# EAGLE design squall-blees-board (EAGLE 7.3.0)
AUTHOR: BLEES Dev Team; REV: A; TITLE: BLEES Sensor Board
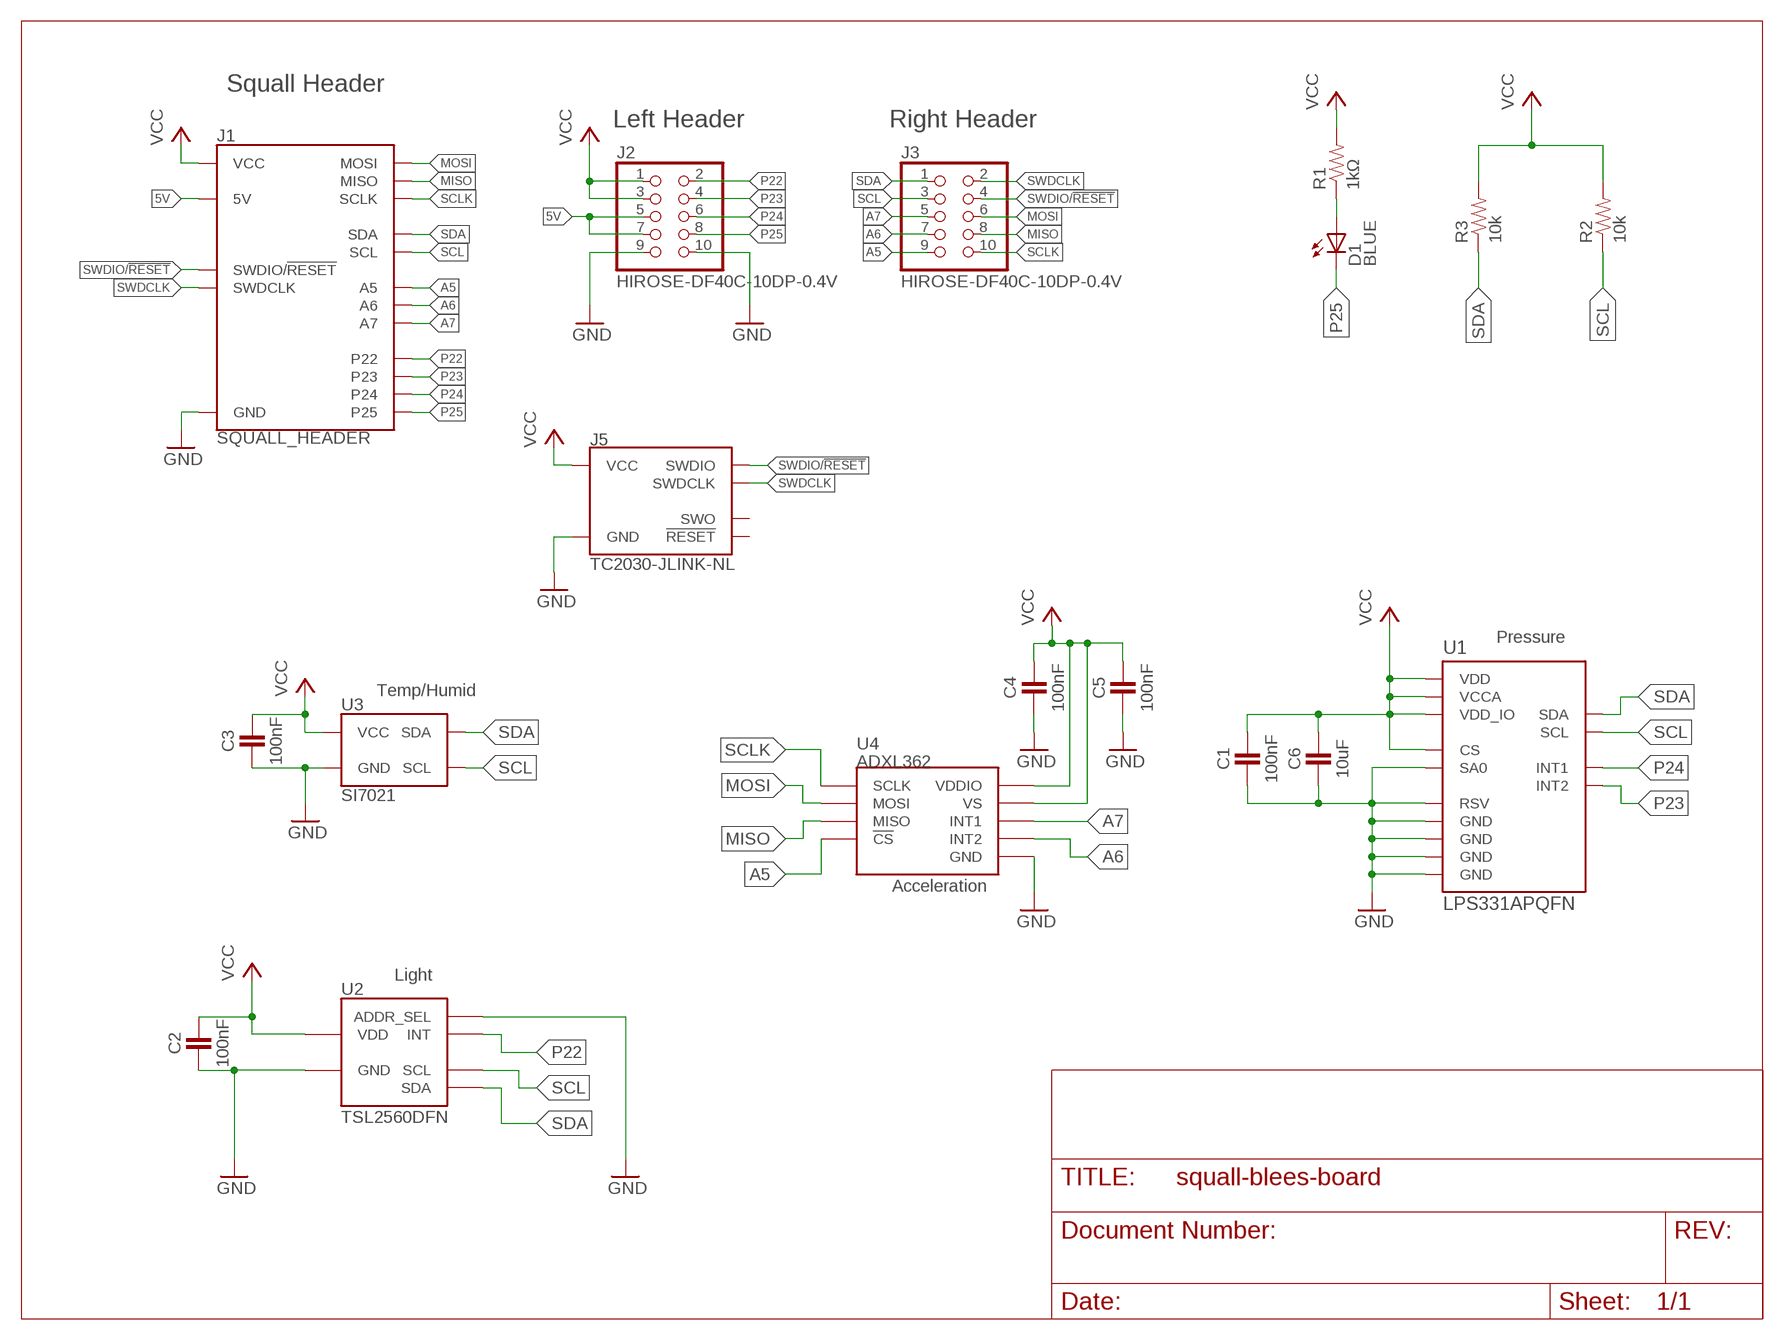
[diagram p0: schematic, sheet 1]

## Parts
C1  100nF  CAPACITOR  [0402_CAP]
C2  100nF  CAPACITOR  [0402_CAP]
C3  100nF  CAPACITOR  [0402_CAP]
C4  100nF  CAPACITOR  [0402_CAP]
C5  100nF  CAPACITOR  [0402_CAP]
C6  10uF  CAPACITOR0603_CAP  [0603_CAP]
D1  BLUE  LED0603  [LED-0603]
J1  SQUALL_HEADER  [SQUALL_HEADER]
J2  HIROSE-DF40C-10DP-0.4V  [2X5/SMD/0.4MM]
J3  HIROSE-DF40C-10DP-0.4V  [2X5/SMD/0.4MM]
J5  TC2030-JLINK-NL  [TC2030-IDC-NL]
R1  1kΩ  RESISTOR0402_RES  [0402_RES]
R2  10k  RESISTOR0402_RES  [0402_RES]
R3  10k  RESISTOR0402_RES  [0402_RES]
U1  LPS331APQFN  [HCLGA-16L]
U2  TSL2560DFN  [DFN2]
U3  SI7021  [DFN-6/3MM]
U4  ADXL362  [ADXL362]

## Nets
5V: J1.A5(5V) J1.A7(5V) J2.5 J2.7
A5: J1.B9(A5) J3.9 U4.P$8(!CS)
A6: J1.B7(A6) J3.7 U4.P$9(INT2)
A7: J1.B5(A7) J3.5 U4.P$11(INT1)
GND: C1.2 C2.2 C3.2 C4.2 C5.2 C6.2 J1.A9(GND) J1.A10(GND) J2.9 J2.10 J5.5(GND) U1.5(GND) U1.7(SA0) U1.10(RSV) U1.12(GND) U1.13(GND) U1.16(GND) U2.2(ADDR_SEL) U2.3(GND) U3.2(GND) U4.P$12(GND) U4.P$13(GND) U4.P$16(GND)
MISO: J1.B8(MISO) J3.8 U4.P$7(MISO)
MOSI: J1.B6(MOSI) J3.6 U4.P$6(MOSI)
N$2: D1.A R1.1
P22: J1.A2(P22) J2.2 U2.5(INT)
P23: J1.A4(P23) J2.4 U1.9(INT2)
P24: J1.A6(P24) J2.6 U1.11(INT1)
P25: D1.C J1.A8(P25) J2.8
SCL: J1.B3(SCL) J3.3 R2.1 U1.4(SCL) U2.4(SCL) U3.6(SCL)
SCLK: J1.B10(SCLK) J3.10 U4.P$4(SCLK)
SDA: J1.B1(SDA) J3.1 R3.1 U1.6(SDA) U2.6(SDA) U3.1(SDA)
SWDCLK: J1.B2(SWDCLK) J3.2 J5.4(SWDCLK)
SWDIO/!RESET: J1.B4(SWDIO/!RESET) J3.4 J5.2(SWDIO)
VCC: C1.1 C2.1 C3.1 C4.1 C5.1 C6.1 J1.A1(VCC) J1.A3(VCC) J2.1 J2.3 J5.1(VCC) R1.2 R2.2 R3.2 U1.1(VDD_IO) U1.8(CS) U1.14(VDD) U1.15(VCCA) U2.1(VDD) U3.5(VCC) U4.P$1(VDDIO) U4.P$14(VS)
Unconnected: J5.3(!RESET) J5.6(SWO)

## Notes on the sheet
- Squall Header
- Left Header | Right Header
- Pressure
- Temp/Humid
- Acceleration
- Light

## Library data of the parts
C1-C6 = passives:CAPACITOR: 0402 Capacitor
D1 = SparkFun-LED:LED: LEDs Standard schematic elements and footprints for 5mm, 3mm, 1206, and 0603 sized LEDs. 5mm - Spark Fun Electronics SKU : COM-00529 (and others)
J1 = squall:SQUALL_HEADER: Header for a sensor board on top of the Squall BLE tag board. Requires two DF40C-10DS-0.4V(51).; DIGIKEY: H11617CT-ND
J2 J3 = headers:HIROSE-DF40C-10DP-0.4V: DF40 Series Header - 0.4MM Pitch; DIGIKEY: H11616CT-ND; MOUSER: 798-DF40C10DP0.4V51; NEWARK: 68X2585
J5 = connector:TC2030-JLINK
R1-R3 = passives:RESISTOR: Resistor Basic schematic elements and footprints for 0603, 1206, and PTH resistors.
U1 = blees:LPS331AP: LPS331AP pressure sensor device designed by BLEES EECS 373
U2 = blees:TSL2560: TSL2560 light to digital converter, written by BLEES EECS 373.
U3 = chips:SI7021: IC TEMP SENSOR RH 2% DFN; DIGIKEY: 336-2542-1-ND
U4 = SparkFun-Sensors:ADXL362: Micropower 3-axis accelerometer 2/4/8g digital output (SPI)

## Board
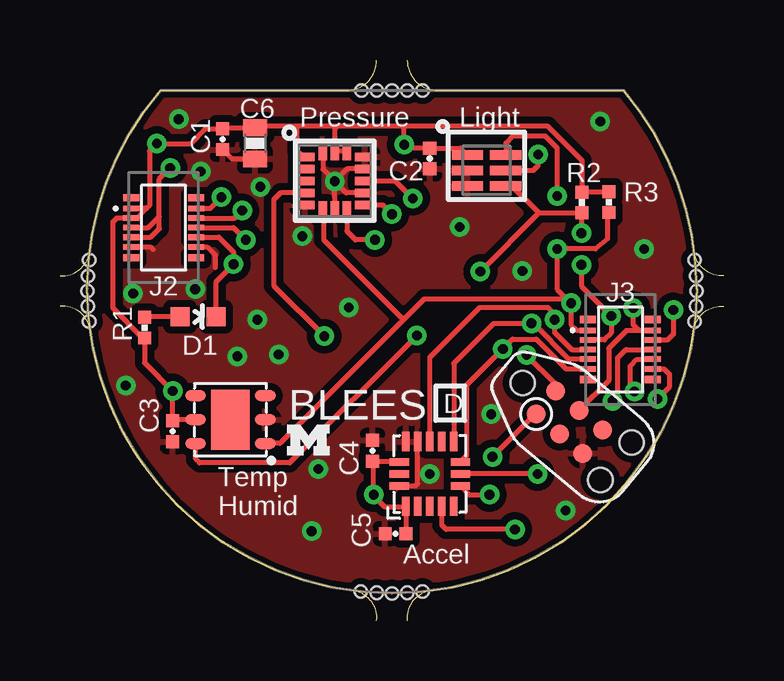
[diagram p1: board, top side]
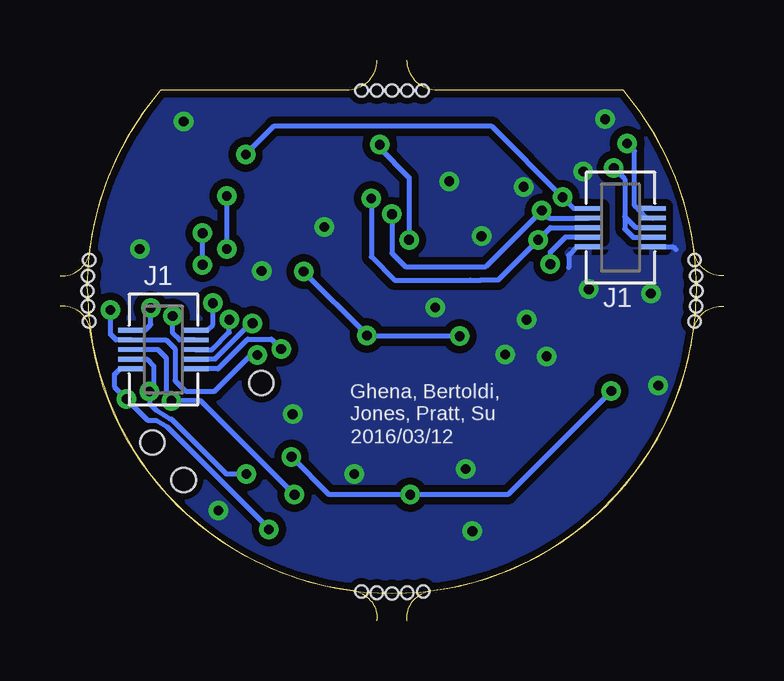
[diagram p2: board, bottom side, seen from below]

Size 27.69 x 23.37 mm. Coordinates in mm from the lower left corner, seen from the top.
Outline: 13.21,23.37 arc-90 11.94,22.1 4.19,22.1 arc33 1.24,15.44 arc-90 0,14.38
Outline: 14.48,23.37 arc90 15.75,22.1 23.49,22.1 arc-33 26.44,15.44 arc90 27.69,14.38
Outline: 0,13.11 arc-90 1.27,12.04 arc75 12.22,1.25 arc-90 13.21,0
Outline: 27.69,13.11 arc90 26.42,12.04 arc-75 15.47,1.25 arc90 14.48,0
Copper layers (1*16): Top 0.0178mm / dielectric 59mil / Bottom 0.0178mm
Design rules "sunstone-2lyr_v1.0.0.3 *": minimum track width 6mil, minimum drill 14mil, track to track 6mil, track to pad 6mil, pad to pad 6mil, via to via 6mil, smd to smd 6mil, copper to edge 10mil, drill to drill 16mil, minimum pad ring 8mil, minimum via ring 8mil, stop-mask expansion 3mil, vias tented up to drill 50mil, thermal gap 10mil
Holes 0.51 mm at 13.84,22.1 14.48,22.1 15.11,22.1 13.21,22.1 12.57,22.1 1.14,13.74 1.17,14.38 1.22,15.04 1.17,13.11 1.22,12.47 26.54,13.74 26.52,14.38 26.47,15.04 26.52,13.11 26.47,12.47 13.84,1.14 13.21,1.17 12.55,1.22 14.48,1.17 15.11,1.22
Milling: 4 lines

### Footprints (pad centres in the part's own frame; a part is rotated, then mirrored left to right if it is on the bottom)
0402_CAP = smd 0.536 x 0.546: 1 -0.433,0; 2 0.433,0
0603_CAP = smd 0.7 x 1: 1 -0.65,0; 2 0.65,0
LED-0603 = smd 0.8 x 0.8: A 0,-0.75; C 0,0.75
SQUALL_HEADER = smd 1.14 x 0.2 bottom: A1 -10.845,3.34; A2 -8.205,3.34; A3 -10.845,2.94; A4 -8.205,2.94; A5 -10.845,2.54; A6 -8.205,2.54; A7 -10.845,2.14; A8 -8.205,2.14; A9 -10.845,1.74; A10 -8.205,1.74; B1 8.205,-1.74; B2 10.845,-1.74; B3 8.205,-2.14; B4 10.845,-2.14; B5 8.205,-2.54; B6 10.845,-2.54; B7 8.205,-2.94; B8 10.845,-2.94; B9 8.205,-3.34; B10 10.845,-3.34
2X5/SMD/0.4MM = smd 0.66 x 0.23: 1 -1.355,0.8; 2 1.355,0.8; 3 -1.355,0.4; 4 1.355,0.4; 5 -1.355,0; 6 1.355,0; 7 -1.355,-0.4; 8 1.355,-0.4; 9 -1.355,-0.8; 10 1.355,-0.8 | smd 0.66 x 0.3: A -1.355,1.25; B 1.355,1.25; C -1.355,-1.25; D 1.355,-1.25
TC2030-IDC-NL = smd 0.787 x 0.787: 1 -1.27,-0.635; 2 -1.27,0.635; 3 0,-0.635; 4 0,0.635; 5 1.27,-0.635; 6 1.27,0.635 | hole 1.016: -2.54,0; 2.54,1.016; 2.54,-1.016
0402_RES = smd 0.536 x 0.546: 1 -0.433,0; 2 0.433,0
HCLGA-16L = smd 0.8 x 0.35: 1 -1.25,1; 2 -1.25,0.5; 3 -1.25,0; 4 -1.25,-0.5; 5 -1.25,-1; 9 1.25,-1; 10 1.25,-0.5; 11 1.25,0; 12 1.25,0.5; 13 1.25,1 | smd 0.35 x 0.8: 6 -0.5,-1.25; 7 0,-1.25; 8 0.5,-1.25; 14 0.5,1.25; 15 0,1.25; 16 -0.5,1.25
DFN2 = smd 1.3 x 0.4: 1 -0.8,0.65; 2 -0.8,0; 3 -0.8,-0.65; 4 0.8,-0.65; 5 0.8,0; 6 0.8,0.65
DFN-6/3MM = smd 0.85 x 0.45: 1 -1.45,1; 2 -1.45,0; 3 -1.45,-1; 4 1.45,-1; 5 1.45,0; 6 1.45,1 | smd 1.6 x 2.5: P$1 0,0
ADXL362 = smd 0.8 x 0.3: P$1 -1.35,1; P$2 -1.35,0.5; P$3 -1.35,0; P$4 -1.35,-0.5; P$5 -1.35,-1; P$9 1.35,-1; P$10 1.35,-0.5; P$11 1.35,0; P$12 1.35,0.5; P$13 1.35,1 | smd 0.3 x 0.8: P$6 -0.5,-1.275; P$7 0,-1.275; P$8 0.5,-1.275; P$14 0.5,1.275; P$15 0,1.275; P$16 -0.5,1.275

### Placement (x,y rotation side)
C1  6.78,20.07 270 top
C2  15.42,19.26 270 top
C3  4.7,7.9 270 top
C4  13.03,7.09 90 top
C5  14,3.63 180 top
C6  8.13,19.89 270 top
D1  5.77,12.67 270 top
J1  13.84,13.84 0 top
J2  4.32,16.38 0 top
J3  23.37,11.3 0 top
J5  21.23,8.28 320 top
R1  3.53,12.22 270 top
R2  21.76,17.43 90 top
R3  22.89,17.44 90 top
U1  11.46,18.33 0 top
U2  17.79,18.77 0 top
U3  7.11,8.38 180 top
U4  15.42,6.12 90 top
U$1  [UMICH_SOLID_50MIL]  10.36,7.54 0 top

### Tracks (layer width: path | path; a pad name or v marks a point on that pad's centre or on a via)
5V  (via drill 0.41)
  Top 0.203: J2.7 3.79,15.98 4.14,16.33 4.14,16.84 | 4.14,16.84 4.14,18.41 v4.6,18.87 | J2.5 3.68,16.38 4.14,16.84
  Bottom 0.203: 4.14,16.84 4.14,18.41 v4.6,18.87 | 4.14,16.84 4.14,16.33 3.78,15.98 3,15.98 J1.A7 | J1.A5 3.68,16.38 4.14,16.84
A5  (via drill 0.41)
  Top 0.203: J1.B9 J3.9 21.09,10.5 19.86,11.74 18.87,11.74 v18.47,11.33 | v18.47,11.33 18.26,11.12 | U4.P$8 16.97,6.9 16.97,9.83 v18.47,11.33
  Bottom 0.203: J1.B9 21.09,10.5 19.86,11.74 18.87,11.74 v18.47,11.33
A6  (via drill 0.41)
  Top 0.203: U4.P$9 16.42,10.73 18.09,12.4 v19.66,12.4 19.74,12.4 21.23,10.9 J3.7
  Bottom 0.203: J1.B7 21.23,10.9 19.74,12.4 v19.66,12.4
A7  (via drill 0.41)
  Top 0.203: J3.5 21.34,11.3 20.62,12.01 v20.62,12.55 20.62,12.78 20.34,13.06 17.5,13.06 15.42,10.97 U4.P$11
  Bottom 0.203: J1.B5 21.34,11.3 20.62,12.01 v20.62,12.55
GND  (via drill 0.41)
  Top 0.203: C1.2 7.18,19.24 C6.2 | J2.10 6.13,15.58 6.48,15.24 6.48,14.73 | U1.5 9.98,17.31 | U1.16 10.96,18.81 v11.46,18.31 | U1.10 11.94,17.83 v11.46,18.31 | U1.12 11.98,18.83 v11.46,18.31 | J2.9 3.77,15.58 3.89,15.47 | U1.7 11.46,17.65 v11.46,18.31 | U4.P$16 14.82,5.62 14.91,5.71 U4.P$12
  Bottom 0.203: J1.A10 6.13,15.58 6.48,15.24 6.48,14.73 | J1.A9 2.12,15.58 2.01,15.47
  other vias: 5.87,18.72 8.23,12.55 24.36,15.49 2.74,9.8 10.49,3.73 10.11,16.03 3.05,13.64 22.53,20.8 15.42,6.12 4.95,20.9 9.12,11.1 8.36,18.08 16.66,16.41 10.77,6.32 7.39,11.02 12.04,13.06 21.08,4.6 19.28,14.58 17.98,8.61 5.64,13.82
  pour Top (isolate 0.305): 26.54,13.84 arc-180 1.14,13.84 arc-41 4.19,22.1 23.49,22.1 arc-41
  pour Bottom (isolate 0.305): 26.54,13.84 arc-180 1.14,13.84 arc-41 4.19,22.1 23.49,22.1 arc-41
MISO  (via drill 0.41)
  Top 0.203: J3.8 24.05,10.9 23.77,10.62 23.77,9.73 v23.95,9.55 | v19.91,6.12 U4.P$7
  Bottom 0.203: J1.B8 24.06,10.9 23.77,10.62 23.77,9.73 v23.95,9.55 23.95,9.04 23.7,8.79 23.06,8.41 23.04,8.41 20.75,6.12 v19.91,6.12
MOSI  (via drill 0.41)
  Top 0.203: U4.P$6 17.06,5.26 v17.91,5.26 | J3.6 23.6,11.3 23.24,10.95 23.24,9.37 v23.04,9.17
  Bottom 0.203: J1.B6 23.6,11.3 23.24,10.95 23.24,9.37 v23.04,9.17 21.82,9.17 v17.91,5.26
N$2
  Top 0.203: D1.A 3.55,12.68 R1.1
P22  (via drill 0.41)
  Top 0.203: J2.2 6.26,17.18 v6.73,17.65 | U2.5 19.73,18.77 19.94,18.97 v19.94,19.43
  Bottom 0.203: J1.A2 6.26,17.18 v6.73,17.65 9.68,20.6 18.77,20.6 v19.94,19.43
P23  (via drill 0.41)
  Top 0.203: 13.5,17.28 v13.84,16.94 13.45,17.33 U1.9 | J2.4 7.28,16.78 v7.6,17.09
  Bottom 0.203: v13.84,16.94 13.84,15.32 13.28,14.76 9.93,14.76 v7.6,17.09 7.28,16.78 J1.A4
P24  (via drill 0.41)
  Top 0.203: J2.6 7.24,16.38 v7.75,15.88 | U1.11 13.97,18.33 v14.71,17.6
  Bottom 0.203: J1.A6 7.24,16.38 v7.75,15.88 9.42,14.2 10.13,14.2 10.59,14.2 13.74,14.2 14.71,15.16 v14.71,17.6
P25  (via drill 0.41)
  Top 0.203: J2.8 6.62,15.98 7.24,15.37 v7.24,14.86 6.52,14.14 D1.C
  Bottom 0.203: J1.A8 6.62,15.98 7.24,15.37 v7.24,14.86
SCL  (via drill 0.41)
  Top 0.203: 9.93,17.8 U1.4 9.2,17.83 8.92,17.55 8.92,13.97 v11.02,11.86 | v14.88,11.89 9.58,6.58 5.82,6.58 5.66,6.73 U3.6 | J3.3 22.71,11.71 22.99,11.99 v22.99,12.7 21.74,13.95 v21.74,14.83 | 19.97,17 R2.1 21.74,16.98 v21.74,16.15 | v17.53,14.55 19.97,17 | U2.4 18.85,18.12 19.97,17
  Bottom 0.203: J1.B3 22.7,11.7 22.99,11.99 v22.99,12.7 | v21.74,14.83 v21.74,16.15 | v11.02,11.86 14.86,11.86 v14.88,11.89 14.88,11.91 v17.53,14.55
SCLK  (via drill 0.41)
  Top 0.203: U4.P$4 15.93,4.76 15.93,3.99 16.1,3.81 v18.97,3.81 | J3.10 25.18,10.5 25.43,10.26 25.43,9.75 v24.92,9.25
  Bottom 0.203: J1.B10 25.18,10.5 25.43,10.26 25.43,9.75 v24.92,9.25 24.03,8.36 23.67,8.36 23.22,8.08 18.97,3.83 v18.97,3.81
SDA  (via drill 0.41)
  Top 0.203: 18.67,19.33 U2.6 18.59,19.91 18.87,20.19 20.24,20.19 20.73,19.71 v20.73,17.7 | U1.6 11,17.08 11,15.88 14.25,12.62 14.4,12.62 | 14.4,12.62 9.17,7.39 U3.1 | R3.1 22.84,16.96 22.84,15.93 22.33,15.49 v20.73,15.49 20.73,13.82 v21.31,13.23 | v21.31,13.23 21.31,12.34 21.55,12.1 J3.1 | 14.4,12.62 15.19,13.41 21.13,13.41 v21.31,13.23
  Bottom 0.203: v20.73,15.49 v20.73,17.7 | J1.B1 21.55,12.1 21.31,12.34 v21.31,13.23
SWDCLK  (via drill 0.41)
  Top 0.203: 21.82,8.77 J5.4 22.88,10.01 22.88,11.35 23.63,12.1 24.14,12.1 | 24.14,12.1 J3.2 | 24.14,12.1 23.9,12.34 v23.9,13.03
  Bottom 0.203: J1.B2 24.14,12.1 23.9,12.34 v23.9,13.03
SWDIO/!RESET  (via drill 0.41)
  Top 0.203: J3.4 25.34,11.7 25.58,11.94 v25.58,12.95 | v19.46,11.07 20.67,9.86 J5.2
  Bottom 0.203: J1.B4 | J1.B4 25.34,11.7 25.58,11.94 v25.58,12.95 | J1.B4 23.26,11.7 22.88,11.33 22.88,10.01 22.45,9.58 21.23,9.58 19.74,11.07 v19.46,11.07
VCC  (via drill 0.41)
  Top 0.203: C1.1 6.82,20.54 C6.1 8.19,20.6 9.88,20.6 | U1.1 9.88,19.56 9.88,20.6 | 3.62,17.18 3.73,17.3 3.73,19.58 v4.04,19.89 5.46,19.89 6.08,20.5 C1.1 | 3.62,17.18 J2.1 | 3.62,17.18 3.22,16.78 J2.3 2.36,16.78 2.21,16.64 2.21,13.03 3.46,11.78 R1.2 3.53,10.74 v4.7,9.58 4.7,8.38 4.72,8.36 | U2.1 16.7,19.7 C2.1 14.49,19.7 v14.35,19.84 14.35,20.6 | R3.2 21.78,17.88 R2.2 21.76,19.18 20.34,20.6 14.35,20.6 | C1.1 6.73,20.5 6.63,20.6 | 4.72,8.36 C3.1 4.72,8.36 | U1.15 11.46,20.5 11.51,20.54 | U1.15 U1.14 | U4.P$14 14.11,6.65 C4.1 13.08,6.6 v13.08,5.26 13.08,5.21 13.54,4.75 14.4,4.75 U4.P$1 14.42,3.64 C5.1 | 14.35,20.6 11.46,20.6 | 11.46,20.6 9.88,20.6 | U1.15 11.46,20.59 11.46,20.6 | U1.8 11.96,16.23 12.32,15.88 v13.13,15.88 | U3.5 4.75,8.38 4.72,8.36 | J5.1 19.81,8.61 v18.03,6.83
  Bottom 0.203: J2.3 J1.A3 3.22,16.78 3.56,17.12 | 3.56,17.12 3.73,17.3 3.73,19.58 v4.04,19.89 | J1.A1 3.49,17.18 3.56,17.12 | v14.35,19.84 14.35,19.69 13.13,18.47 v13.13,15.88 | v4.7,9.58 9.02,5.26 v13.08,5.26 16.46,5.26 v18.03,6.83

### Text on the board
tPlace: Pressure | Light | BLEES | D | Temp / Humid | Accel
bPlace: J1 | J1 | Ghena, Bertoldi, / Jones, Pratt, Su | 2016/03/12